# Altium schematic sheet main.SchDoc: Main schematic
size A4; Author: HappyDonuts; Revision: 1.0; SheetNumber: 1; SheetTotal: 1; SPICEModelCacheYSUBEUBN: <root> / <DocumentId>YSUBEUBN</DocumentId> / </root>
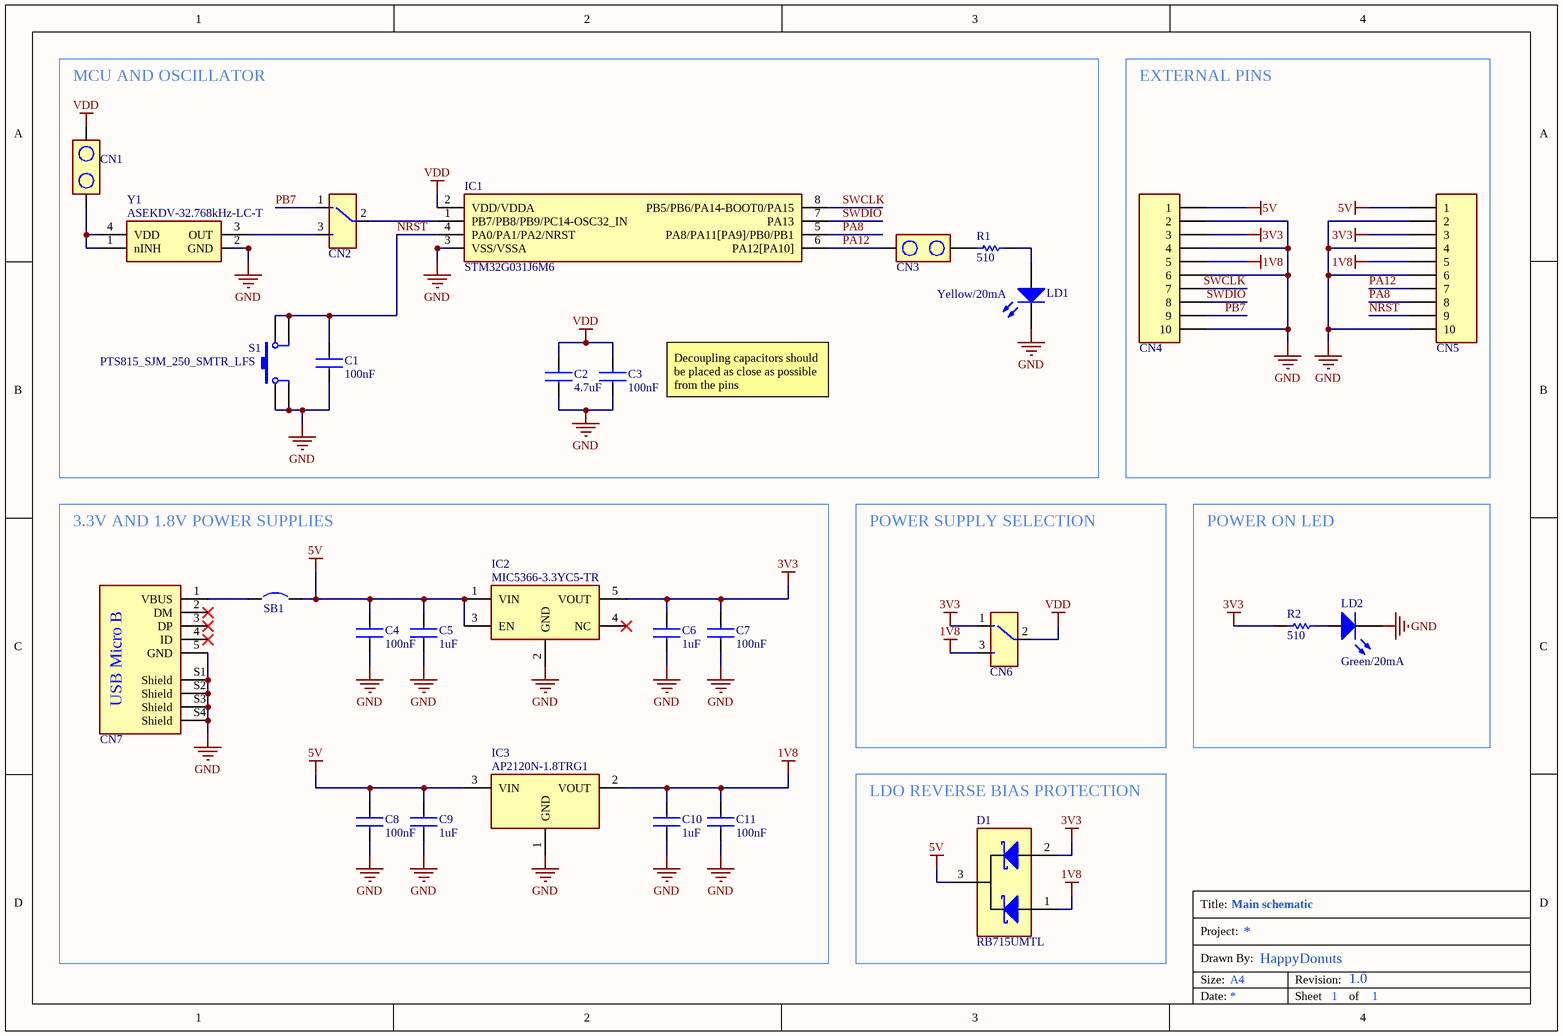
[diagram p0: main.SchDoc]

## Parts
C1  value 100nF  [CAPC2012X94N]  (hidden comment: C0805C104K5RAC7411)
C2  value 4.7uF  [CAPC2012X135N]  (hidden comment: CL21A475KPFNNNE)
C3  value 100nF  [CAPC2012X94N]  (hidden comment: C0805C104K5RAC7411)
C4  value 100nF  [CAPC2012X94N]  (hidden comment: C0805C104K5RAC7411)
C5  value 1uF  [CAPC2012X135N]  (hidden comment: 885012107015)
C6  value 1uF  [CAPC2012X135N]  (hidden comment: 885012107015)
C7  value 100nF  [CAPC2012X94N]  (hidden comment: C0805C104K5RAC7411)
C8  value 100nF  [CAPC2012X94N]  (hidden comment: C0805C104K5RAC7411)
C9  value 1uF  [CAPC2012X135N]  (hidden comment: 885012107015)
C10  value 1uF  [CAPC2012X135N]  (hidden comment: 885012107015)
C11  value 100nF  [CAPC2012X94N]  (hidden comment: C0805C104K5RAC7411)
CN1  CN_2PIN  [CN_2PIN]  (value not drawn)
CN2  CN_3PIN  [CN_3PIN]  (value not drawn)
CN3  CN_2PIN  [CN_2PIN]  (value not drawn)
CN4  CN_10PIN  [CN_10PIN]  (value not drawn)
CN5  CN_10PIN  [CN_10PIN]  (value not drawn)
CN6  CN_3PIN  [CN_3PIN]  (value not drawn)
CN7  USB_B_AE  [USB_B_AE]  (value not drawn)
D1  RB715UMTL  [DAN217UMTL]
IC1  STM32G031J6M6  [SOIC127P600X175-8N]
IC2  MIC5366-3.3YC5-TR  [SOT65P210X110-5N]
IC3  AP2120N-1.8TRG1  [SOT95P230X110-3N]
LD1  value Yellow/20mA  [LEDC2012X85N_Y]  (hidden comment: LTST-C171KSKT)
LD2  value Green/20mA  [LEDC2012X85N_G]  (hidden comment: LTST-C171KGKT)
R1  value 510  [RESC2012X60N]  (hidden comment: RC0805FR-07510RL)
R2  value 510  [RESC2012X60N]  (hidden comment: RC0805FR-07510RL)
S1  PTS815_SJM_250_SMTR_LFS  [PTS815SJM250SMTRLFS]
SB1  RC0805FR-070RL  [RESC2012X60N]  (value not drawn)
Y1  ASEKDV-32.768kHz-LC-T  [ASEKDV-32.768kHz-LC-T]

## Blocks framed on the sheet
MCU AND OSCILLATOR: C1-C3 CN1-CN3 IC1 LD1 R1 S1 Y1
EXTERNAL PINS: CN4 CN5
POWER SUPPLY SELECTION: CN6
POWER ON LED: LD2 R2
LDO REVERSE BIAS PROTECTION: D1

## Nets
1V8: C10.2 C11.2 CN4.5 CN5.5 CN6.3 D1.1(K_1) IC3.2(VOUT)
3V3: C6.2 C7.2 CN4.3 CN5.3 CN6.1 D1.2(K_2) IC2.5(VOUT) R2.1
5V: C4.2 C5.2 C8.2 C9.2 CN4.1 CN5.1 D1.3(COM_A) IC2.1(VIN) IC2.3(EN) IC3.3(VIN) SB1.2
GND: C1.1 C2.1 C3.1 C4.1 C5.1 C6.1 C7.1 C8.1 C9.1 C10.1 C11.1 CN4.2 CN4.4 CN4.6 CN4.10 CN5.2 CN5.4 CN5.6 CN5.10 CN7.5(GND) CN7.S1(Shield) CN7.S2(Shield) CN7.S3(Shield) CN7.S4(Shield) IC1.3(VSS/VSSA) IC2.2(GND) IC3.1(GND) LD1.1(K) LD2.1(K) S1.1 S1.2 Y1.2(GND)
VDD: C2.2 C3.2 CN1.2 CN6.2 IC1.2(VDD/VDDA)
NRST: C1.2 CN5.9 IC1.4(PA0/PA1/PA2/NRST) S1.3 S1.4
PA8: CN5.8 IC1.5(PA8/PA11[PA9]/PB0/PB1)
PA12: CN3.1 CN5.7 IC1.6(PA12[PA10])
PB7: CN2.1 CN4.9
SWCLK: CN4.7 IC1.8(PB5/PB6/PA14-BOOT0/PA15)
SWDIO: CN4.8 IC1.7(PA13)
NetCN1_1: CN1.1 Y1.1(nINH) Y1.4(VDD)
NetCN2_2: CN2.2 IC1.1(PB7/PB8/PB9/PC14-OSC32_IN)
NetCN2_3: CN2.3 Y1.3(OUT)
NetCN3_2: CN3.2 R1.1
NetCN7_1: CN7.1(VBUS) SB1.1
NetLD1_2: LD1.2(A) R1.2
NetLD2_2: LD2.2(A) R2.2

Not connected (* = marked no-connect by the designer): CN7 2(DM)* 3(DP)* 4(ID)*; IC2 4(NC)*

## Notes on the sheet
- Decoupling capacitors should be placed as close as possible from the pins
- 3.3V AND 1.8V POWER SUPPLIES
- USB Micro B
- Title:
- Size:
- Date:
- Drawn By:
- Project:
- A4
- Revision:
- Sheet
- of

## Library data of the parts
C1 C3 C4 C7 C8 C11 = C0805C104K5RAC7411: Capacitor; Manufacturer_Name: Kemet; Datasheet Link: https://www.mouser.com/datasheet/2/212/KEM_C1002_X7R_SMD-1102033.pdf; Height: 0.88mm; Manufacturer_Part_Number: C0805C104K5RAC7411; Mouser Part Number: 80-C0805C104K5RACLR; Mouser Price/Stock: https://www.mouser.co.uk/ProductDetail/KEMET/C0805C104K5RAC7411?qs=jbRM9o5BbzPcVXF0wW9AYg%3D%3D; Arrow Part Number: C0805C104K5RAC7411; Arrow Price/Stock: https://www.arrow.com/en/products/c0805c104k5rac7411/kemet-corporation
C2 = CL21A475KPFNNNE: Capacitor; Manufacturer_Name: Wurth Elektronik; Datasheet Link: https://www.mouser.fr/datasheet/2/585/MLCC-1837944.pdf; Height: 1.35mm; Manufacturer_Part_Number: CL21A475KPFNNNE; Mouser Part Number: 187-CL21A475KPFNNNE; Mouser Price/Stock: https://www.mouser.co.uk/ProductDetail/Wurth-Elektronik/885012107015?qs=0KOYDY2FL2%252BNQREZP%252BtVoQ%3D%3D
C5 C6 C9 C10 = 885012107015: Capacitor; Manufacturer_Name: Wurth Elektronik; Datasheet Link: https://katalog.we-online.com/pbs/datasheet/885012107015.pdf; Height: 1.35mm; Manufacturer_Part_Number: 885012107015; Mouser Part Number: 710-885012107015; Mouser Price/Stock: https://www.mouser.co.uk/ProductDetail/Wurth-Elektronik/885012107015?qs=0KOYDY2FL2%252BNQREZP%252BtVoQ%3D%3D
CN1 CN3 = CN_2PIN: Connector
CN2 CN6 = CN_3PIN: Connector
CN4 CN5 = CN_10PIN: Connector
CN7 = USB_B_AE: USB connector
D1 = RB715UMTL: Schottky Diode; Manufacturer_Name: ROHM Semiconductor; Datasheet Link: http://uk.rs-online.com/web/p/products/1835297; Height: 1mm; Manufacturer_Part_Number: RB715UMTL; Mouser Part Number: 755-RB715UMTL; Mouser Price/Stock: https://www.mouser.co.uk/ProductDetail/ROHM-Semiconductor/RB715UMTL?qs=HXFqYaX1Q2wTXMfu8QxCQg%3D%3D
IC1 = STM32G031J6M6: Integrated Circuit; Manufacturer_Name: STMicroelectronics; Datasheet Link: https://www.mouser.fr/datasheet/2/389/dm00613879-1799607.pdf; Height: 1.75mm; Manufacturer_Part_Number: STM32G031J6M6; Mouser Part Number: 511-STM32G031J6M6
IC2 = MIC5366-3.3YC5-TR: LDO; Manufacturer_Name: Microchip; Value: 3.3V/150mA; Datasheet Link: https://www.mouser.fr/datasheet/2/268/MIC5365_6_High_Performance_Single_150mA_LDO_DS2000-2826882.pdf; Height: 1.1mm; Manufacturer_Part_Number: MIC5366-3.3YC5-TR; Mouser Part Number: 998-MIC5366-3.3YC5TR; Mouser Price/Stock: https://www.mouser.co.uk/ProductDetail/Microchip-Technology-Micrel/MIC5365-33YC5-TR?qs=U6T8BxXiZAXvJj%252BPZ%252B301w%3D%3D; Arrow Part Number: MIC5365-3.3YC5-TR; Arrow Price/Stock: https://www.arrow.com/en/products/mic5365-3.3yc5-tr/microchip-technology?region=nac
IC3 = AP2120N-1.8TRG1: LDO; Manufacturer_Name: Diodes Inc.; Value: 1.8V/150mA; Datasheet Link: https://datasheet.datasheetarchive.com/originals/distributors/Datasheets_SAMA/eefff3041187ea13496cd4a0771f8fec.pdf; Height: 1.1mm; Manufacturer_Part_Number: AP2120N-1.8TRG1; Mouser Part Number: 621-AP2120N-1.8TRG1; Mouser Price/Stock: https://www.mouser.co.uk/ProductDetail/Diodes-Incorporated/AP2120N-18TRG1?qs=x6A8l6qLYDC3T4tUK6BUJA%3D%3D; Arrow Part Number: AP2120N-1.8TRG1; Arrow Price/Stock: https://www.arrow.com/en/products/ap2120n-1.8trg1/diodes-incorporated
LD1 = LTST-C171KSKT: LED; Manufacturer_Name: Lite-On; Datasheet Link: https://componentsearchengine.com/Datasheets/1/LTST-C171KSKT.pdf; Height: 0.9mm; Manufacturer_Part_Number: LTST-C171KSKT; Mouser Part Number: 859-LTST-C171KSKT; Mouser Price/Stock: https://www.mouser.co.uk/ProductDetail/Lite-On/LTST-C171KSKT?qs=llMtm9xcdM0CwR1bByTaUQ%3D%3D; Arrow Part Number: LTST-C171KSKT; Arrow Price/Stock: https://www.arrow.com/en/products/ltst-c171kskt/lite-on-technology?region=nac
LD2 = LTST-C171KGKT: LED; Manufacturer_Name: Lite-On; Datasheet Link: https://optoelectronics.liteon.com/upload/download/DS22-2000-118/LTST-C171KGKT.pdf; Height: 0.9mm; Manufacturer_Part_Number: LTST-C171KGKT; Mouser Part Number: 859-LTST-C171KGKT; Mouser Price/Stock: https://www.mouser.co.uk/ProductDetail/Lite-On/LTST-C171KGKT?qs=j1zysehuyChA38z%2F%252BFfUSw%3D%3D; Arrow Part Number: LTST-C171KGKT; Arrow Price/Stock: https://www.arrow.com/en/products/ltst-c171kgkt/lite-on-technology?region=nac
R1 R2 = RC0805FR-07510RL: Resistor; Manufacturer_Name: YAGEO (PHYCOMP); Datasheet Link: https://datasheet.datasheetarchive.com/originals/distributors/Datasheets_SAMA/902f9e387b938f871d31120f5fc1d65e.pdf; Height: 0.6mm; Manufacturer_Part_Number: RC0805FR-07510RL; Mouser Part Number: 603-RC0805FR-07510RL; Mouser Price/Stock: https://www.mouser.com/Search/Refine.aspx?Keyword=603-RC0805FR-07510RL
S1 = PTS815_SJM_250_SMTR_LFS: Switch; Manufacturer_Name: C & K COMPONENTS; Manufacturer_Part_Number: PTS815 SJM 250 SMTR LFS; Datasheet Link: https://componentsearchengine.com/Datasheets/1/PTS815 SJM 250 SMTR LFS.pdf; Height: 2.7mm; Mouser Part Number: 611-PTS815SJM250SMTR; Mouser Price/Stock: https://www.mouser.co.uk/ProductDetail/CK/PTS815-SJM-250-SMTR-LFS?qs=ahcBuItHZ3xKWmfV%2F2E6bA%3D%3D; Arrow Part Number: PTS815 SJM 250 SMTR LFS; Arrow Price/Stock: https://www.arrow.com/en/products/pts815-sjm-250-smtr-lfs/ck
SB1 = RC0805FR-070RL: Jumper (0 ohm); Manufacturer_Name: YAGEO (PHYCOMP); Datasheet Link: https://datasheet.datasheetarchive.com/originals/distributors/Datasheets_SAMA/902f9e387b938f871d31120f5fc1d65e.pdf; Height: 0.6mm; Manufacturer_Part_Number: RC0805FR-070RL; Mouser Part Number: 603-RC0805FR-070RL; Mouser Price/Stock: https://www.mouser.co.uk/ProductDetail/YAGEO/RC0805FR-070RL?qs=fRxXYNj8ftF6kXqh1XbZJQ%3D%3D
Y1 = ASEKDV-32.768kHz-LC-T: Crystal or Oscillator; Manufacturer_Name: ABRACON; Datasheet Link: https://www.mouser.fr/datasheet/2/3/ABRC_S_A0012625913_1-2519507.pdf; Height: 1.2mm; Manufacturer_Part_Number: ASEKDV-32.768kHz-LC-T; Mouser Part Number: 815-ASEKDV32768KHLCT; Value: 32.768kHz